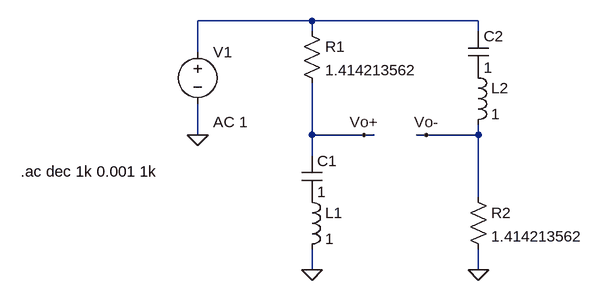
[diagram p0: schematic Ej1Pasivo.asc]
Ej1Pasivo.asc, the LTspice schematic file:
Version 4
SHEET 1 880 680
WIRE 128 80 -48 80
WIRE 384 80 128 80
WIRE 128 96 128 80
WIRE 384 96 384 80
WIRE -48 128 -48 80
WIRE -48 256 -48 208
WIRE 128 256 128 176
WIRE 208 256 128 256
WIRE 224 256 208 256
WIRE 304 256 288 256
WIRE 384 256 384 240
WIRE 384 256 304 256
WIRE 128 288 128 256
WIRE 384 352 384 256
WIRE 128 464 128 432
WIRE 384 464 384 432
FLAG -48 256 0
FLAG 128 464 0
FLAG 384 464 0
FLAG 208 256 Vo+
FLAG 304 256 Vo-
SYMBOL voltage -48 112 R0
WINDOW 123 24 124 Left 2
WINDOW 39 0 0 Left 0
SYMATTR Value2 AC 1
SYMATTR InstName V1
SYMATTR Value ""
SYMBOL res 112 80 R0
SYMATTR InstName R1
SYMATTR Value 1.414213562
SYMBOL cap 112 288 R0
SYMATTR InstName C1
SYMATTR Value 1
SYMBOL ind 112 336 R0
SYMATTR InstName L1
SYMATTR Value 1
SYMBOL cap 368 96 R0
SYMATTR InstName C2
SYMATTR Value 1
SYMBOL ind 368 144 R0
SYMATTR InstName L2
SYMATTR Value 1
SYMBOL res 368 336 R0
SYMATTR InstName R2
SYMATTR Value 1.414213562
TEXT -320 312 Left 2 !.ac dec 1k 0.001 1k

The netlist it stands for:
* Ej1Pasivo.asc
V1 N001 0 AC 1
R1 N001 Vo+ 1.414213562
C1 Vo+ P001 1
L1 P001 0 1
C2 N001 P002 1
L2 P002 Vo- 1
R2 Vo- 0 1.414213562
.ac dec 1k 0.001 1k
.backanno
.end